# Altium schematic sheet Python.SchDoc
size A
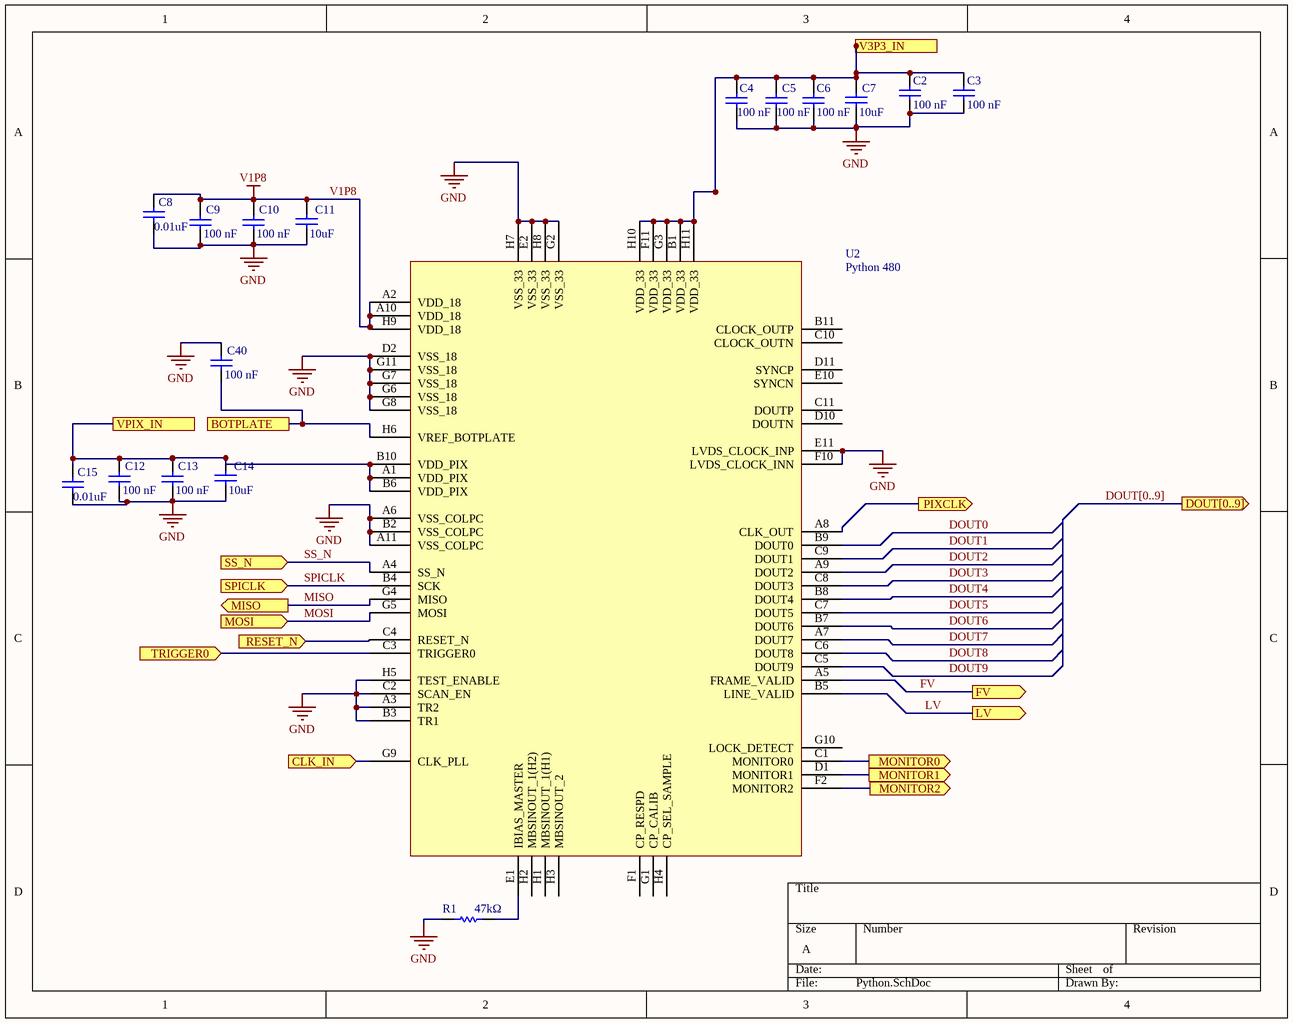
[diagram p0: Python.SchDoc]

## Parts
C2  Capacitance: 100 nF  [PCB-v6eq6etc9p7u7qdkgnno-1]  (hidden comment: GRM033C71C104KE14D)
C3  Capacitance: 100 nF  [PCB-v6eq6etc9p7u7qdkgnno-1]  (hidden comment: GRM033C71C104KE14D)
C4  Capacitance: 100 nF  [PCB-v6eq6etc9p7u7qdkgnno-1]  (hidden comment: GRM033C71C104KE14D)
C5  Capacitance: 100 nF  [PCB-v6eq6etc9p7u7qdkgnno-1]  (hidden comment: GRM033C71C104KE14D)
C6  Capacitance: 100 nF  [PCB-v6eq6etc9p7u7qdkgnno-1]  (hidden comment: GRM033C71C104KE14D)
C7  Capacitance: 10uF  [PCB-uspfzztrpe7hn2xlyjz9-1]  (hidden comment: GRM155R61A106ME11D)
C8  Capacitance: 0.01uF  [PCB-v6eq6etc9p7u7qdkgnno-1]  (hidden comment: GRM033R71A103KA01D)
C9  Capacitance: 100 nF  [PCB-v6eq6etc9p7u7qdkgnno-1]  (hidden comment: GRM033C71C104KE14D)
C10  Capacitance: 100 nF  [PCB-v6eq6etc9p7u7qdkgnno-1]  (hidden comment: GRM033C71C104KE14D)
C11  Capacitance: 10uF  [PCB-uspfzztrpe7hn2xlyjz9-1]  (hidden comment: GRM155R61A106ME11D)
C12  Capacitance: 100 nF  [PCB-v6eq6etc9p7u7qdkgnno-1]  (hidden comment: GRM033C71C104KE14D)
C13  Capacitance: 100 nF  [PCB-v6eq6etc9p7u7qdkgnno-1]  (hidden comment: GRM033C71C104KE14D)
C14  Capacitance: 10uF  [PCB-uspfzztrpe7hn2xlyjz9-1]  (hidden comment: GRM155R61A106ME11D)
C15  Capacitance: 0.01uF  [PCB-v6eq6etc9p7u7qdkgnno-1]  (hidden comment: GRM033R71A103KA01D)
C40  Capacitance: 100 nF  [PCB-v6eq6etc9p7u7qdkgnno-1]  (hidden comment: GRM033C71C104KE14D)
R1  Resistance: 47kΩ  [PCB-7g93mzch2qc2q3jid3ok-1]  (hidden comment: ERJ-1GNF4702C)
U2  Python 480  [Python 480]

## Ports
BOTPLATE, CLK_IN (in), DOUT[0..9] (out), FV (out), LV (out), MISO (out), MONITOR0 (out), MONITOR1 (out), MONITOR2 (out), MOSI (in), PIXCLK (out), RESET_N (in), SPICLK (in), SS_N (in), TRIGGER0 (in), V3P3_IN, VPIX_IN

## Nets
GND: C2.1 C3.1 C4.1 C5.1 C6.1 C7.2 C8.1 C9.1 C10.1 C11.2 C12.1 C13.1 C14.2 C15.1 C40.2 R1.1 U2.A3(TR2) U2.A6(VSS_COLPC) U2.A11(VSS_COLPC) U2.B2(VSS_COLPC) U2.B3(TR1) U2.C2(SCAN_EN) U2.D2(VSS_18) U2.E2(VSS_33) U2.E11(LVDS_CLOCK_INP) U2.F10(LVDS_CLOCK_INN) U2.G2(VSS_33) U2.G6(VSS_18) U2.G7(VSS_18) U2.G8(VSS_18) U2.G11(VSS_18) U2.H5(TEST_ENABLE) U2.H7(VSS_33) U2.H8(VSS_33)
V1P8: C8.2 C9.2 C10.2 C11.1 U2.A2(VDD_18) U2.A10(VDD_18) U2.H9(VDD_18)
BOTPLATE: C40.1 U2.H6(VREF_BOTPLATE) ; port BOTPLATE
CLK_IN: U2.G9(CLK_PLL) ; port CLK_IN
DOUT0: U2.B9(DOUT0)
DOUT1: U2.C9(DOUT1)
DOUT2: U2.A9(DOUT2)
DOUT3: U2.C8(DOUT3)
DOUT4: U2.B8(DOUT4)
DOUT5: U2.C7(DOUT5)
DOUT6: U2.B7(DOUT6)
DOUT7: U2.A7(DOUT7)
DOUT8: U2.C6(DOUT8)
DOUT9: U2.C5(DOUT9)
FV: U2.A5(FRAME_VALID) ; port FV
LV: U2.B5(LINE_VALID) ; port LV
MISO: U2.G4(MISO) ; port MISO
MONITOR0: U2.C1(MONITOR0) ; port MONITOR0
MONITOR1: U2.D1(MONITOR1) ; port MONITOR1
MONITOR2: U2.F2(MONITOR2) ; port MONITOR2
MOSI: U2.G5(MOSI) ; port MOSI
PIXCLK: U2.A8(CLK_OUT) ; port PIXCLK
RESET_N: U2.C4(RESET_N) ; port RESET_N
SPICLK: U2.B4(SCK) ; port SPICLK
SS_N: U2.A4(SS_N) ; port SS_N
TRIGGER0: U2.C3(TRIGGER0) ; port TRIGGER0
V3P3_IN: C2.2 C3.2 C4.2 C5.2 C6.2 C7.1 U2.B1(VDD_33) U2.F11(VDD_33) U2.G3(VDD_33) U2.H10(VDD_33) U2.H11(VDD_33) ; port V3P3_IN
VPIX_IN: C12.2 C13.2 C14.1 C15.2 U2.A1(VDD_PIX) U2.B6(VDD_PIX) U2.B10(VDD_PIX) ; port VPIX_IN
NetR1_2: R1.2 U2.E1(IBIAS_MASTER)

Not connected (* = marked no-connect by the designer): U2 B11(CLOCK_OUTP) C10(CLOCK_OUTN) C11(DOUTP) D10(DOUTN) D11(SYNCP) E10(SYNCN) F1(CP_RESPD) G1(CP_CALIB) G10(LOCK_DETECT) H1(MBSINOUT_1(H1)) H2(MBSINOUT_1(H2)) H3(MBSINOUT_2) H4(CP_SEL_SAMPLE)

## Buses and harness runs
bus DOUT[0..9] = port DOUT[0..9]

## Library data of the parts
C2-C6 C9 C10 C12 C13 C40 = CMP-cc290632c88a13ee-3: 0.1 µF ±10% 16V Ceramic Capacitor X7S 0201 (0603 Metric); Lead-Free Status: Lead Free; Voltage Rating (DC): 16.0 V; Packaging: Reel; Dielectric Characteristic: X7S; OctopartID: cc290632c88a13ee; Size-Width: 300 µm; Manufacturer Part Number: GRM033C71C104KE14D; Case/Package: 0201; Capacitance Tolerance: ±10%; Size-Length: 600 µm; Octopart URL: http://octopart.com/grm033c71c104ke14d-murata-51454405; Mounting Style: Surface Mount; Size-Thickness: 300 µm; RoHS: Compliant
C7 C11 C14 = CMP-eacb22ede71a350c-8: 10 µF ±20% 10V Ceramic Capacitor X5R 0402 (1005 Metric)
C8 C15 = CMP-19299660-4: 10000 pF ±10% 10V Ceramic Capacitor X7R 0201 (0603 Metric); Case/Package: 0201
R1 = CMP-1848656-4: 47 kOhms ±1% 0.05W, 1/20W Chip Resistor 0201 (0603 Metric) Automotive AEC-Q200 Thick Film; Lead-Free Status: Lead Free; Voltage Rating (DC): 15.0 V; Case/Package: 0201; Lifecycle Status: Not Listed by Manufacturer; Mounting Style: Surface Mount; Octopart Url: https://octopart.com/erj-1gef1822c-panasonic-39782564; OctopartID: 543c9f6979fe8bfb; Power Rating: 0.05 W; Resistance Tolerance: ±1%; RoHS: Compliant; Size-Height: 0.00023 m; Size-Width: 0.0003 m
U2 = CMP-zuljd18wlr9in3443qu3-3: image sensor from ONSemi